# Altium project 多普勒打板1.0.PrjPcb
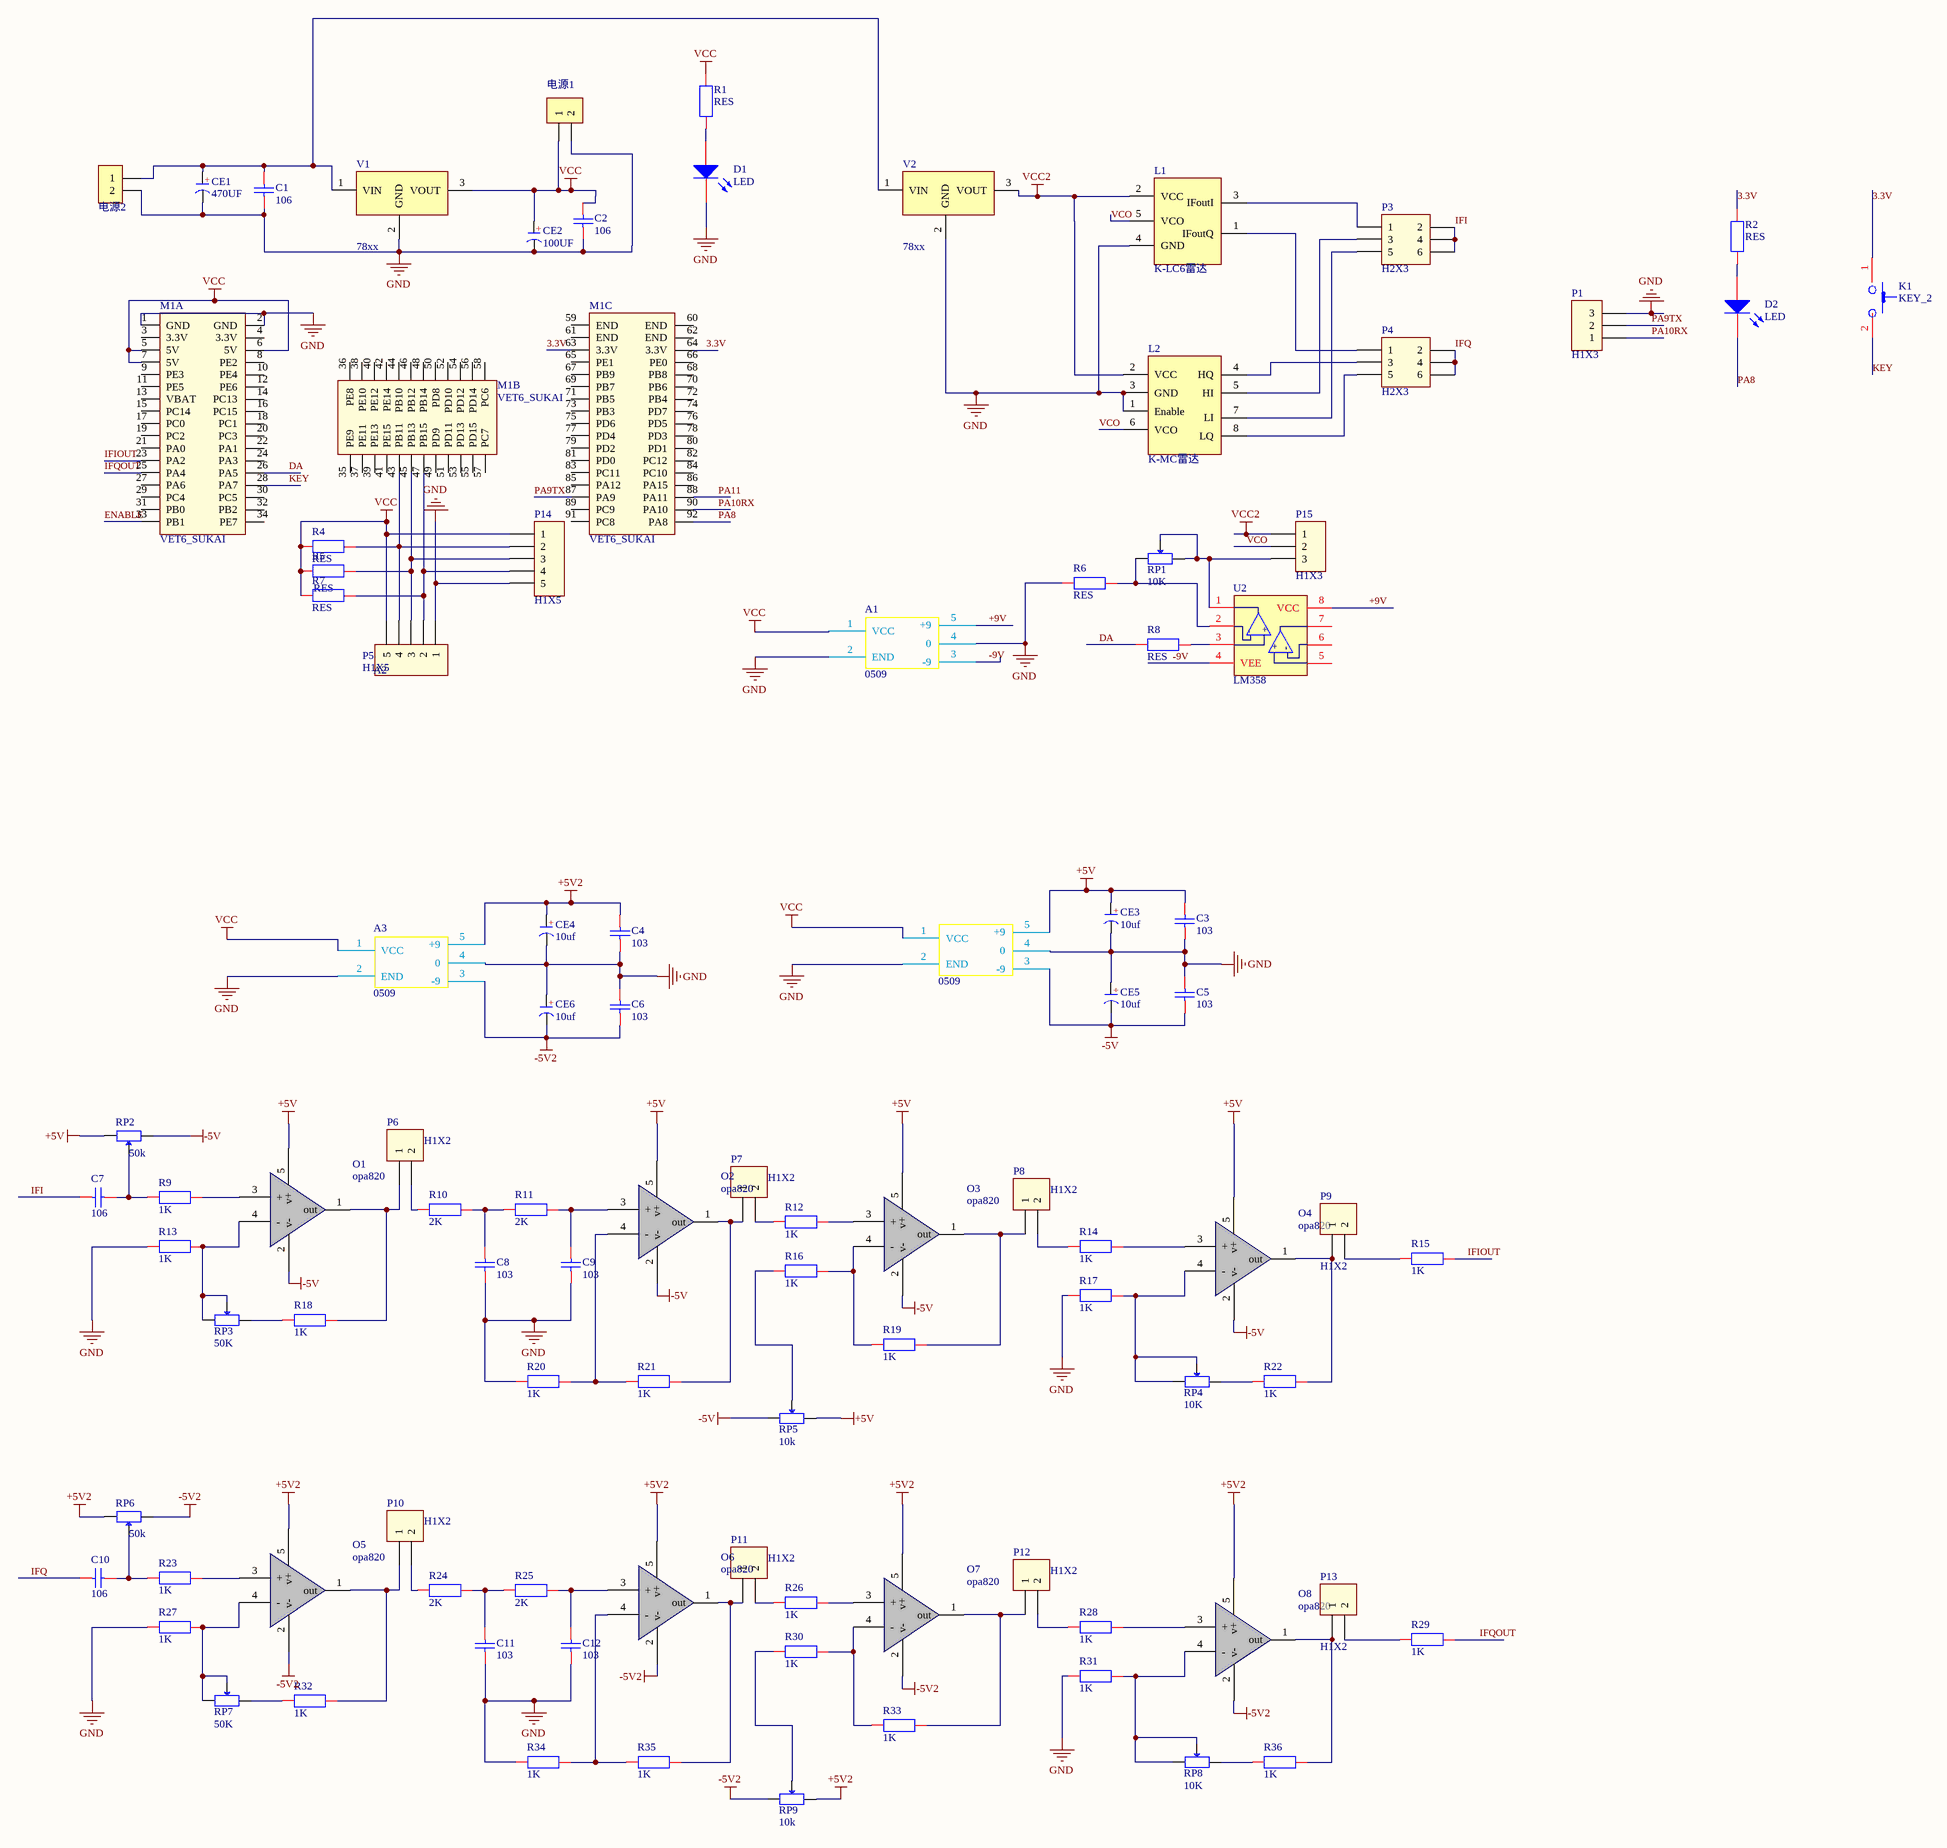
[diagram p0: 多普勒1.0.SchDoc]
1 sheet, 98 parts. Net scope: global (net labels, ports and power ports of the same name join across sheets).
Board file: 多普勒1.0.PcbDoc

## Sheet 多普勒1.0.SchDoc
size A2

### Parts
A1  0509  [0509]
A2  0509  [0509]
A3  0509  [0509]
C1  106  [CAP[0805]]
C2  106  [CAP[0805]]
C3  103  [CAP[0805]]
C4  103  [CAP[0805]]
C5  103  [CAP[0805]]
C6  103  [CAP[0805]]
C7  106  [CAP[0805]]
C8  103  [CAP[0805]]
C9  103  [CAP[0805]]
C10  106  [CAP[0805]]
C11  103  [CAP[0805]]
C12  103  [CAP[0805]]
CE1  470UF  [CAP 5.0*10*16]
CE2  100UF  [CAP 5.0*10*16]
CE3  10uf  [CAP 2.5*5*11 - BK]
CE4  10uf  [CAP 2.5*5*11 - BK]
CE5  10uf  [CAP 2.5*5*11 - BK]
CE6  10uf  [CAP 2.5*5*11 - BK]
D1  LED  [LED[0805]]
D2  LED  [LED]
K1  KEY_2  [KEY_2]
L1  K-LC6雷达  [K-LC6雷达]
L2  K-MC雷达  [K-MC1雷达]
M1  VET6_SUKAI  [VET6_SUKAI]  (parts A,B,C of 3)
O1  opa820  [opa820_5]
O2  opa820  [opa820_5]
O3  opa820  [opa820_5]
O4  opa820  [opa820_5]
O5  opa820  [opa820_5]
O6  opa820  [opa820_5]
O7  opa820  [opa820_5]
O8  opa820  [opa820_5]
P1  H1X3  [H2.54_1X3]
P3  H2X3  [H2.54_2X3]
P4  H2X3  [H2.54_2X3]
P5  H1X5  [H2.54_1X5]
P6  H1X2  [H2.54_1X2]
P7  H1X2  [H2.54_1X2]
P8  H1X2  [H2.54_1X2]
P9  H1X2  [H2.54_1X2]
P10  H1X2  [H2.54_1X2]
P11  H1X2  [H2.54_1X2]
P12  H1X2  [H2.54_1X2]
P13  H1X2  [H2.54_1X2]
P14  H1X5  [H2.54_1X5]
P15  H1X3  [H2.54_1X3]
R1  RES  [RES[0805]]
R2  RES  [RES[0805]]
R4  RES  [RES[0805]]
R5  RES  [RES[0805]]
R6  RES  [RES[0805]]
R7  RES  [RES[0805]]
R8  RES  [RES[0805]]
R9  1K  [RES[0805]]
R10  2K  [RES[0805]]
R11  2K  [RES[0805]]
R12  1K  [RES[0805]]
R13  1K  [RES[0805]]
R14  1K  [RES[0805]]
R15  1K  [RES[0805]]
R16  1K  [RES[0805]]
R17  1K  [RES[0805]]
R18  1K  [RES[0805]]
R19  1K  [RES[0805]]
R20  1K  [RES[0805]]
R21  1K  [RES[0805]]
R22  1K  [RES[0805]]
R23  1K  [RES[0805]]
R24  2K  [RES[0805]]
R25  2K  [RES[0805]]
R26  1K  [RES[0805]]
R27  1K  [RES[0805]]
R28  1K  [RES[0805]]
R29  1K  [RES[0805]]
R30  1K  [RES[0805]]
R31  1K  [RES[0805]]
R32  1K  [RES[0805]]
R33  1K  [RES[0805]]
R34  1K  [RES[0805]]
R35  1K  [RES[0805]]
R36  1K  [RES[0805]]
RP1  10K  [3296W]
RP2  50k  [3296W]
RP3  50K  [3296W]
RP4  10K  [3296W]
RP5  10k  [3296W]
RP6  50k  [3296W]
RP7  50K  [3296W]
RP8  10K  [3296W]
RP9  10k  [3296W]
U2  LM358  [SOP_8]
V1  78xx  [TO220A]
V2  78xx  [TO220A]
电源1  HDR-1X2  [XH2.54-LI-2P]  (value not drawn)
电源2  HDR-1X2  [XH2.54-LI-2P]  (value not drawn)

### Nets
+5V: A2.5(+9) C3.2 CE3.1(A) O1.5(v+) O2.5(v+) O3.5(v+) O4.5(v+) RP2.3 RP5.3
+5V2: A3.5(+9) C4.2 CE4.1(A) O5.5(v+) O6.5(v+) O7.5(v+) O8.5(v+) RP6.3 RP9.3
-5V: A2.3(-9) C5.1 CE5.2(K) O1.2(v-) O2.2(v-) O3.2(v-) O4.2(v-) RP2.1 RP5.1
-5V2: A3.3(-9) C6.1 CE6.2(K) O5.2(v-) O6.2(v-) O7.2(v-) O8.2(v-) RP6.1 RP9.1
GND: A1.2(END) A1.4(0) A2.2(END) A2.4(0) A3.2(END) A3.4(0) C1.1 C2.1 C3.1 C4.1 C5.2 C6.2 C8.2 C9.2 C11.2 C12.2 CE1.2(K) CE2.2(K) CE3.2(K) CE4.2(K) CE5.1(A) CE6.1(A) D1.2(K) L1.4(GND) L2.1(Enable) L2.3(GND) M1.1(GND) M1.2(GND) P1.3 P5.1 P14.5 R6.1 R13.1 R17.1 R20.1 R27.1 R31.1 R34.1 V1.2(GND) V2.2(GND) 电源1.2 电源2.2
VCC: A1.1(VCC) A2.1(VCC) A3.1(VCC) C2.2 CE2.1(A) M1.5(5V) M1.6(5V) M1.7(5V) P5.5 P14.1 R1.2 R4.1 R5.1 R7.1 V1.3(VOUT) 电源1.1
VCC2: L1.2(VCC) L2.2(VCC) P15.1 V2.3(VOUT)
3.3V: K1.1 M1.63(3.3V) M1.64(3.3V) R2.2
+9V: A1.5(+9) U2.8(VCC)
-9V: A1.3(-9) U2.4(VEE)
DA: M1.26(PA5) R8.1
ENABLE: M1.33(PB1)
IFI: C7.1 P3.2 P3.4 P3.6
IFIOUT: M1.23(PA2) R15.2
IFQ: C10.1 P4.2 P4.4 P4.6
IFQOUT: M1.25(PA4) R29.2
KEY: K1.2 M1.28(PA7)
PA8: D2.2(K) M1.92(PA8)
PA9TX: M1.87(PA9) P1.2
PA10RX: M1.90(PA10) P1.1
PA11: M1.88(PA11)
VCO: L1.5(VCO) L2.6(VCO) P15.2
NetC1_2: C1.2 CE1.1(A) V1.1(VIN) V2.1(VIN) 电源2.1
NetC7_2: C7.2 R9.1 RP2.2
NetC8_1: C8.1 R10.2 R11.1
NetC9_1: C9.1 O2.3(+) R11.2
NetC10_2: C10.2 R23.1 RP6.2
NetC11_1: C11.1 R24.2 R25.1
NetC12_1: C12.1 O6.3(+) R25.2
NetD1_1: D1.1(A) R1.1
NetD2_1: D2.1(A) R2.1
NetL1_1: L1.1(IFoutQ) P4.1
NetL1_3: L1.3(IFoutI) P3.1
NetL2_4: L2.4(HQ) P4.3
NetL2_5: L2.5(HI) P3.3
NetL2_7: L2.7(LI) P3.5
NetL2_8: L2.8(LQ) P4.5
NetM1_43: M1.43(PB11) P5.4 P14.2 R4.2
NetM1_45: M1.45(PB13) P5.3 P14.3 R5.2
NetM1_47: M1.47(PB15) P5.2 P14.4 R7.2
NetO1_1: O1.1(out) P6.1 R18.2
NetO1_3: O1.3(+) R9.2
NetO1_4: O1.4(-) R13.2 RP3.1 RP3.2
NetO2_1: O2.1(out) P7.1 R21.2
NetO2_4: O2.4(-) R20.2 R21.1
NetO3_1: O3.1(out) P8.1 R19.2
NetO3_3: O3.3(+) R12.2
NetO3_4: O3.4(-) R16.2 R19.1
NetO4_1: O4.1(out) P9.1 R22.2
NetO4_3: O4.3(+) R14.2
NetO4_4: O4.4(-) R17.2 RP4.1 RP4.2
NetO5_1: O5.1(out) P10.1 R32.2
NetO5_3: O5.3(+) R23.2
NetO5_4: O5.4(-) R27.2 RP7.1 RP7.2
NetO6_1: O6.1(out) P11.1 R35.2
NetO6_4: O6.4(-) R34.2 R35.1
NetO7_1: O7.1(out) P12.1 R33.2
NetO7_3: O7.3(+) R26.2
NetO7_4: O7.4(-) R30.2 R33.1
NetO8_1: O8.1(out) P13.1 R36.2
NetO8_3: O8.3(+) R28.2
NetO8_4: O8.4(-) R31.2 RP8.1 RP8.2
NetP6_2: P6.2 R10.1
NetP7_2: P7.2 R12.1
NetP8_2: P8.2 R14.1
NetP9_2: P9.2 R15.1
NetP10_2: P10.2 R24.1
NetP11_2: P11.2 R26.1
NetP12_2: P12.2 R28.1
NetP13_2: P13.2 R29.1
NetP15_3: P15.3 RP1.2 RP1.3 U2.1(OUTA)
NetR6_2: R6.2 RP1.1 U2.2(IN1-)
NetR8_2: R8.2 U2.3(IN1+)
NetR16_1: R16.1 RP5.2
NetR18_1: R18.1 RP3.3
NetR22_1: R22.1 RP4.3
NetR30_1: R30.1 RP9.2
NetR32_1: R32.1 RP7.3
NetR36_1: R36.1 RP8.3

Not connected (* = marked no-connect by the designer): M1 3(3.3V) 4(3.3V) 8(PE2) 9(PE3) 10(PE4) 11(PE5) 12(PE6) 13(VBAT) 14(PC13) 15(PC14) 16(PC15) 17(PC0) 18(PC1) 19(PC2) 20(PC3) 21(PA0) 22(PA1) 24(PA3) 27(PA6) 29(PC4) 30(PC5) 31(PB0) 32(PB2) 34(PE7) 35(PE9) 36(PE8) 37(PE11) 38(PE10) 39(PE13) 40(PE12) 41(PE15) 42(PE14) 44(PB10) 46(PB12) 48(PB14) 49(PD9) 50(PD8) 51(PD11) 52(PD10) 53(PD13) 54(PD12) 55(PD15) 56(PD14) 57(PC7) 58(PC6) 59(END) 60(END) 61(END) 62(END) 65(PE1) 66(PE0) 67(PB9) 68(PB8) 69(PB7) 70(PB6) 71(PB5) 72(PB4) 73(PB3) 74(PD7) 75(PD6) 76(PD5) 77(PD4) 78(PD3) 79(PD2) 80(PD1) 81(PD0) 82(PC12) 83(PC11) 84(PC10) 85(PA12) 86(PA15) 89(PC9) 91(PC8); U2 5(IN2+) 6(IN2-) 7(OUTB)

### Notes on the sheet
- (in symbol CE) +
- (in symbol LM358) -; +

### Library data of the parts
C1-C12 = CAP
CE1-CE6 = CE: 直插电解电容; 淘宝ID: 封装库来自淘宝 ID：黄晶宝石; BOM名称: 直插电解电容; 联系售后: https://shop463601444.taobao.com
R9-R36 = RES
RP1-RP9 = RP: 单联电位器; BOM名称: 插件电位器; 版权归属: 封装库来自淘宝 ID：黄晶宝石; 联系售后: https://shop463601444.taobao.com
V1 V2 = 78xx: LM78XX系列线性稳压芯片; BOM名称: 线性稳压芯片; 淘宝ID: 封装库来自淘宝 ID：黄晶宝石; 技术支持，联系售后: 其他店铺购入均为盗版，不享受售后技术支持服务，请立即申请退款; 技术支持，联系售后，唯一出售店铺网址: https://shop463601444.taobao.com
电源1 电源2 = Header 2: 2P接插件; 版权归属: 封装库来自淘宝 ID：黄晶宝石; BOM名称: 2P接插件; 联系售后: https://shop463601444.taobao.com